# Altium schematic sheet prog.SchDoc
size A
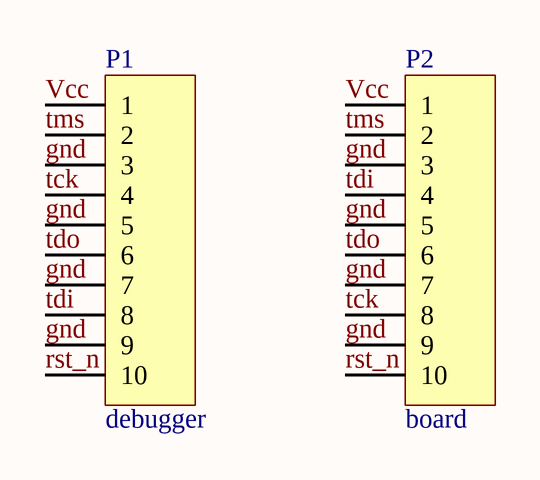
[diagram p0: prog.SchDoc]

## Parts
P1  debugger  [HDR1X10]
P2  board  [HDR1X10]

## Nets
gnd: P1.3 P1.5 P1.7 P1.9 P2.3 P2.5 P2.7 P2.9
rst_n: P1.10 P2.10
tck: P1.4 P2.8
tdi: P1.8 P2.4
tdo: P1.6 P2.6
tms: P1.2 P2.2
Vcc: P1.1 P2.1

## Library data of the parts
P1 P2 = Header 10: Header, 10-Pin; LatestRevisionDate: 17-Jul-2002; LatestRevisionNote: Re-released for DXP Platform.; Publisher: Altium Limited